# Altium schematic sheet Block_Diagram.SchDoc
size A3; Date: 29/01/2025; Engineer: Emirhan BOZKURT; SheetNumber: 2; SheetTotal: 5; PageSize: A3; Position: R&D Electronics Engineer
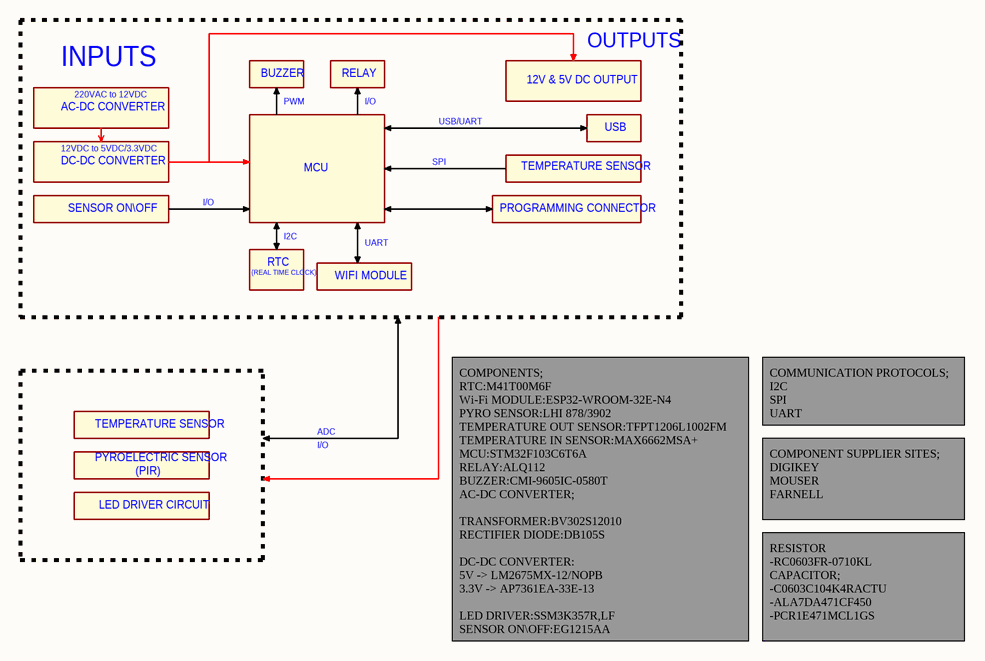
[diagram p0: Block_Diagram.SchDoc]

## Notes on the sheet
- INPUTS
- BUZZER
- RELAY
- OUTPUTS
- AC-DC CONVERTER
- 12VDC to 5VDC/3.3VDC
- 220VAC to 12VDC
- PWM
- I/O
- USB/UART
- 12V & 5V DC OUTPUT
- USB
- DC-DC CONVERTER
- SENSOR ON\OFF
- MCU
- SPI
- PROGRAMMING CONNECTOR
- TEMPERATURE SENSOR
- (REAL TIME CLOCK)
- RTC
- I2C
- WIFI MODULE
- UART
- COMMUNICATION PROTOCOLS;
  I2C
  SPI
  UART
- PYROELECTRIC SENSOR
- (PIR)
- ADC
- LED DRIVER CIRCUIT
- COMPONENT SUPPLIER SITES;
  DIGIKEY
  MOUSER
  FARNELL
- COMPONENTS;
  RTC:M41T00M6F
  Wi-Fi MODULE:ESP32-WROOM-32E-N4
  PYRO SENSOR:LHI 878/3902
  TEMPERATURE OUT SENSOR:TFPT1206L1002FM
  TEMPERATURE IN SENSOR:MAX6662MSA+
  MCU:STM32F103C6T6A
  RELAY:ALQ112
  BUZZER:CMI-9605IC-0580T
  AC-DC CONVERTER;
  TRANSFORMER:BV302S12010
  RECTIFIER DIODE:DB105S
  DC-DC CONVERTER:
  5V -> LM2675MX-12/NOPB
  3.3V -> AP7361EA-33E-13
  LED DRIVER:SSM3K357R,LF
  SENSOR ON\OFF:EG1215AA
- RESISTOR
  -RC0603FR-0710KL
  CAPACITOR;
  -C0603C104K4RACTU
  -ALA7DA471CF450
  -PCR1E471MCL1GS
- Document Name:
- Designed By:
- Department:
- Project Name:
- Sheet Number:
- Size:
- Date: